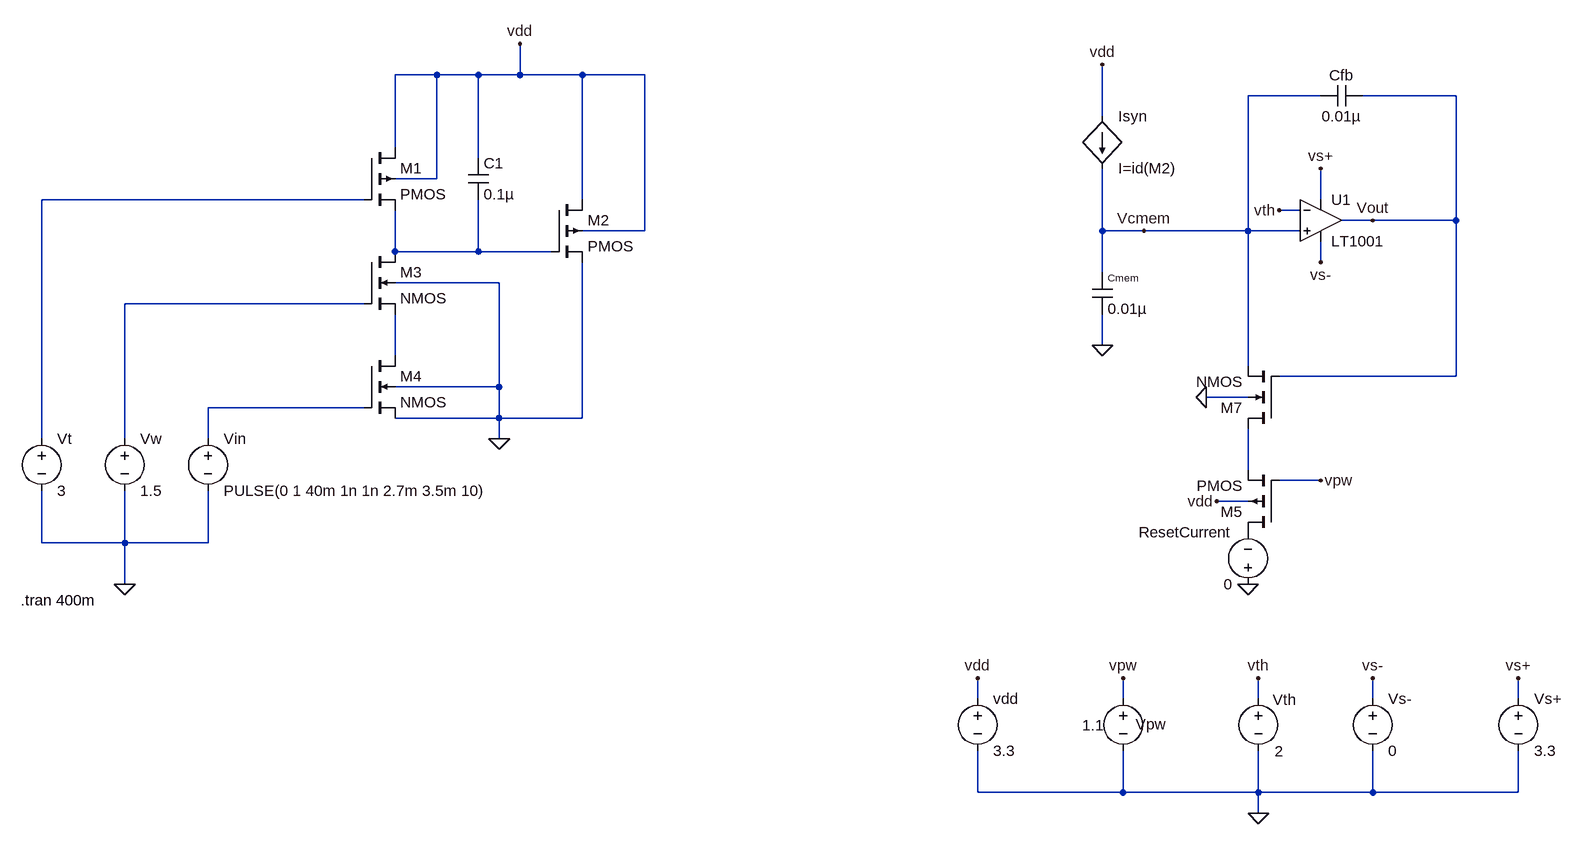
[diagram p0: schematic mmn13_q4_subD.asc]
mmn13_q4_subD.asc, the LTspice schematic file:
Version 4.1
SHEET 1 2520 948
WIRE 128 -208 64 -208
WIRE 192 -208 128 -208
WIRE 256 -208 256 -256
WIRE 256 -208 192 -208
WIRE 352 -208 256 -208
WIRE 448 -208 352 -208
WIRE 1488 -176 1376 -176
WIRE 1696 -176 1552 -176
WIRE 1152 -144 1152 -224
WIRE 64 -96 64 -208
WIRE 192 -80 192 -208
WIRE 128 -48 128 -208
WIRE 128 -48 64 -48
WIRE 16 -16 -480 -16
WIRE 352 -16 352 -208
WIRE 1488 -16 1488 -64
WIRE 1456 0 1424 0
WIRE 1568 16 1520 16
WIRE 1696 16 1696 -176
WIRE 1696 16 1568 16
WIRE 448 32 448 -208
WIRE 448 32 352 32
WIRE 1152 32 1152 -64
WIRE 1216 32 1152 32
WIRE 1376 32 1376 -176
WIRE 1376 32 1216 32
WIRE 1456 32 1376 32
WIRE 64 64 64 0
WIRE 192 64 192 -16
WIRE 192 64 64 64
WIRE 304 64 192 64
WIRE 1488 80 1488 48
WIRE 1152 96 1152 32
WIRE 224 112 64 112
WIRE 16 144 -352 144
WIRE 1152 208 1152 160
WIRE 64 224 64 160
WIRE 1376 240 1376 32
WIRE 1696 256 1696 16
WIRE 1696 256 1424 256
WIRE 224 272 224 112
WIRE 224 272 64 272
WIRE 1376 288 1312 288
WIRE 16 304 -224 304
WIRE 224 320 224 272
WIRE 224 320 64 320
WIRE 352 320 352 80
WIRE 352 320 224 320
WIRE -480 352 -480 -16
WIRE -352 352 -352 144
WIRE -224 352 -224 304
WIRE 224 352 224 320
WIRE 1376 400 1376 336
WIRE 1488 416 1424 416
WIRE 1376 448 1328 448
WIRE -480 512 -480 432
WIRE -352 512 -352 432
WIRE -352 512 -480 512
WIRE -224 512 -224 432
WIRE -224 512 -352 512
WIRE -352 576 -352 512
WIRE 960 752 960 720
WIRE 1184 752 1184 720
WIRE 1392 752 1392 720
WIRE 1568 752 1568 720
WIRE 1792 752 1792 720
WIRE 960 896 960 832
WIRE 1184 896 1184 832
WIRE 1184 896 960 896
WIRE 1392 896 1392 832
WIRE 1392 896 1184 896
WIRE 1568 896 1568 832
WIRE 1568 896 1392 896
WIRE 1792 896 1792 832
WIRE 1792 896 1568 896
WIRE 1392 928 1392 896
FLAG 224 352 0
FLAG -352 576 0
FLAG 1152 208 0
FLAG 1152 -224 vdd
FLAG 960 720 vdd
FLAG 1328 448 vdd
FLAG 1312 288 0
FLAG 1184 720 vpw
FLAG 1392 720 vth
FLAG 1568 720 vs-
FLAG 1792 720 vs+
FLAG 1424 0 vth
FLAG 1488 80 vs-
FLAG 1488 -64 vs+
FLAG 1392 928 0
FLAG 256 -256 vdd
FLAG 1488 416 vpw
FLAG 1376 576 0
FLAG 1568 16 Vout
FLAG 1216 32 Vcmem
SYMBOL pmos4 16 -96 R0
SYMATTR InstName M1
SYMBOL pmos4 304 -16 R0
SYMATTR InstName M2
SYMBOL nmos4 16 64 R0
SYMATTR InstName M3
SYMBOL nmos4 16 224 R0
SYMATTR InstName M4
SYMBOL cap 176 -80 R0
SYMATTR InstName C1
SYMATTR Value 0.1µ
SYMBOL voltage -480 336 R0
WINDOW 123 0 0 Left 0
WINDOW 39 0 0 Left 0
SYMATTR InstName Vt
SYMATTR Value 3
SYMBOL voltage -352 336 R0
WINDOW 123 0 0 Left 0
WINDOW 39 0 0 Left 0
SYMATTR InstName Vw
SYMATTR Value 1.5
SYMBOL voltage -224 336 R0
WINDOW 123 0 0 Left 0
WINDOW 39 0 0 Left 0
SYMATTR InstName Vin
SYMATTR Value PULSE(0 1 40m 1n 1n 2.7m 3.5m 10)
SYMBOL voltage 1792 736 R0
SYMATTR InstName Vs+
SYMATTR Value 3.3
SYMBOL voltage 1568 736 R0
SYMATTR InstName Vs-
SYMATTR Value 0
SYMBOL voltage 1392 736 R0
WINDOW 0 40 2 Top 2
WINDOW 3 32 81 Top 2
WINDOW 123 0 0 Left 0
WINDOW 39 0 0 Left 0
SYMATTR InstName Vth
SYMATTR Value 2
SYMBOL cap 1136 96 R0
WINDOW 0 24 8 Left 1
SYMATTR InstName Cmem
SYMATTR Value 0.01µ
SYMBOL voltage 1184 736 R0
WINDOW 0 19 55 Left 2
WINDOW 3 -46 41 Top 2
WINDOW 123 0 0 Left 0
WINDOW 39 0 0 Left 0
SYMATTR InstName Vpw
SYMATTR Value 1.1
SYMBOL nmos4 1424 336 R180
SYMATTR InstName M7
SYMBOL pmos4 1424 496 R180
SYMATTR InstName M5
SYMBOL bi 1152 -144 R0
SYMATTR InstName Isyn
SYMATTR Value I=id(M2)
SYMBOL voltage 960 736 R0
SYMATTR InstName vdd
SYMATTR Value 3.3
SYMBOL LT1001 1488 -48 R0
SYMATTR InstName U1
SYMBOL cap 1488 -160 R270
WINDOW 0 32 32 VTop 2
WINDOW 3 0 32 VBottom 2
SYMATTR InstName Cfb
SYMATTR Value 0.01µ
SYMBOL voltage 1376 592 R180
WINDOW 0 24 96 Left 2
WINDOW 3 24 16 Left 2
SYMATTR InstName ResetCurrent
SYMATTR Value 0
TEXT -512 600 Left 2 !.tran 400m

The netlist it stands for:
* mmn13_q4_subD.asc
M1 vdd N001 N002 vdd PMOS
M2 vdd N002 0 vdd PMOS
M3 N002 N003 N004 0 NMOS
M4 N004 N005 0 0 NMOS
C1 vdd N002 0.1µ
Vt N001 0 3
Vw N003 0 1.5
Vin N005 0 PULSE(0 1 40m 1n 1n 2.7m 3.5m 10)
Vs+ vs+ 0 3.3
Vs- vs- 0 0
Vth vth 0 2
Cmem Vcmem 0 0.01µ
Vpw vpw 0 1.1
M7 N006 Vout Vcmem 0 NMOS
M5 P001 vpw N006 vdd PMOS
B§Isyn vdd Vcmem I=id(M2)
vdd vdd 0 3.3
X§U1 Vcmem vth vs+ vs- Vout LT1001  ; pins In+ In- V+ V- OUT
Cfb Vcmem Vout 0.01µ
V§ResetCurrent 0 P001 0
.model NMOS NMOS
.model PMOS PMOS
.lib standard.mos
.tran 400m
.lib LTC.lib
.backanno
.end